# EasyEDA Pro project RCKid.epro, board TestBoard
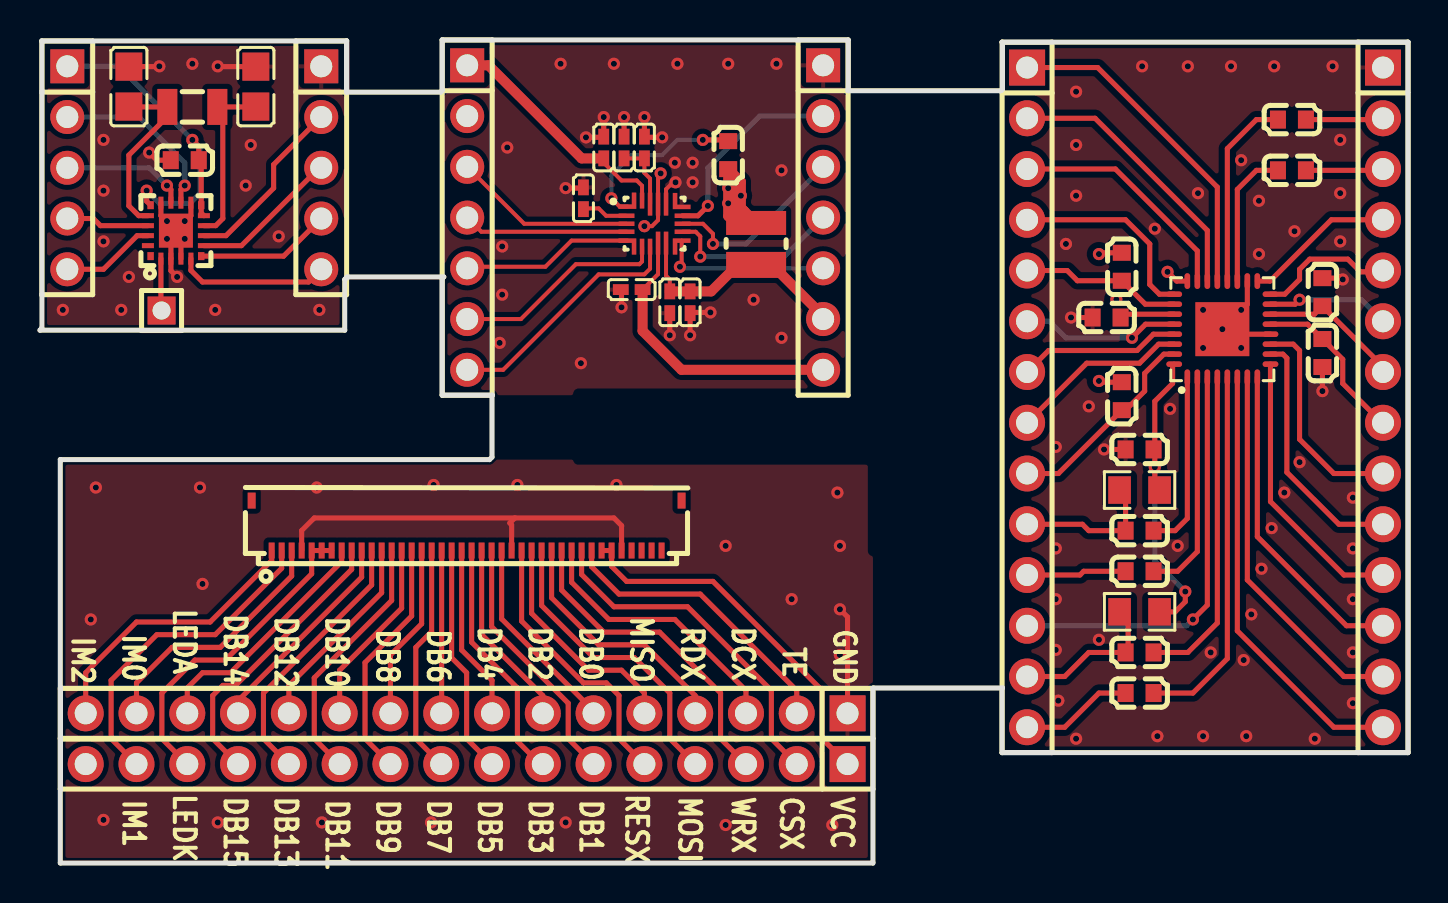
[diagram p25: board, top side]
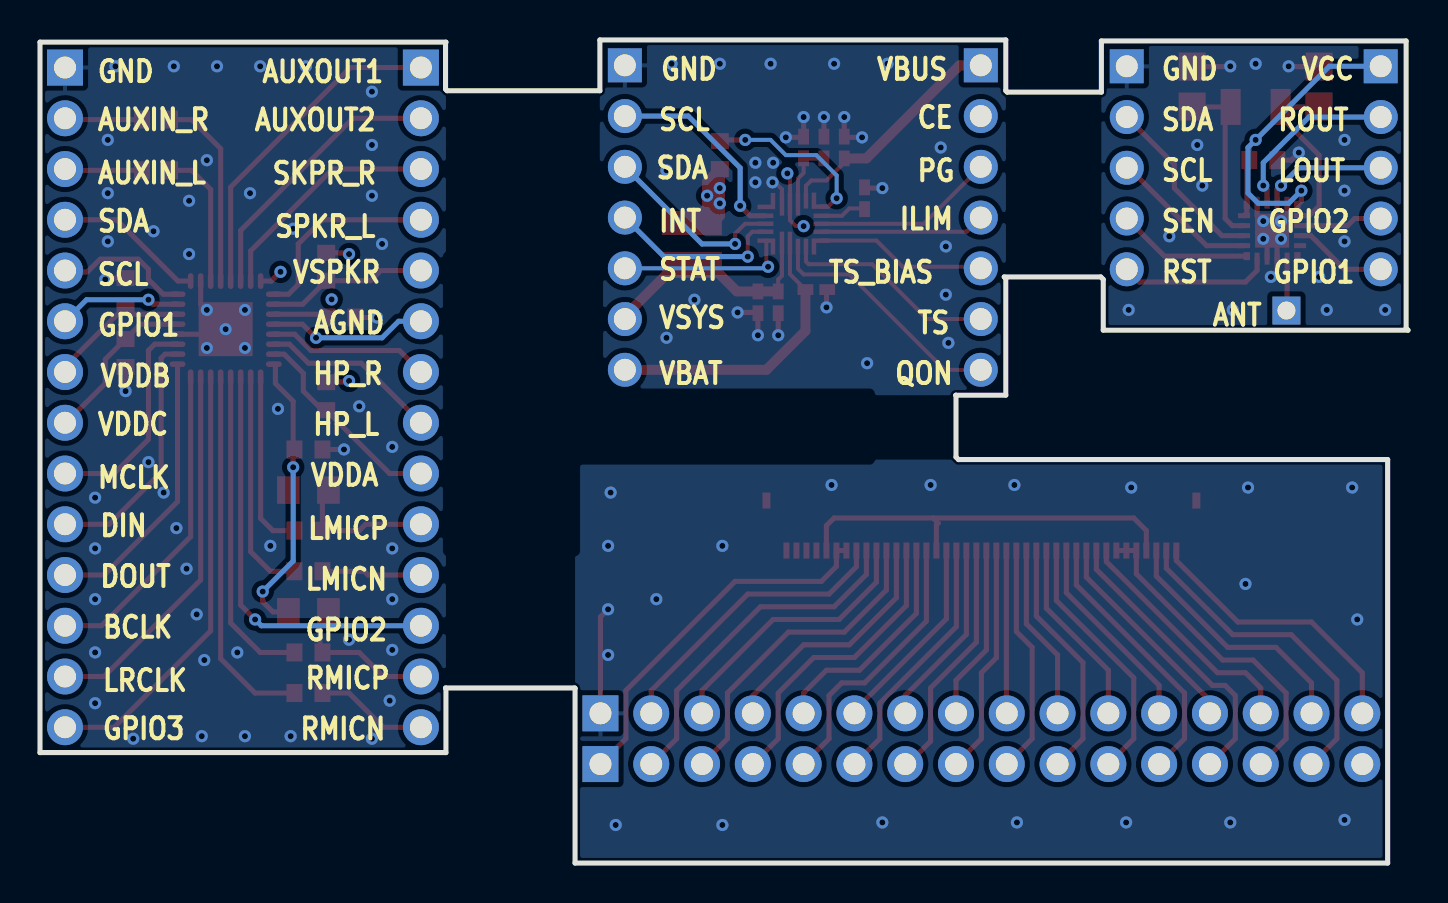
[diagram p26: board, bottom side, seen from below]

Outline 68.42 x 41.2 mm; copper layers: Top Layer, Inner1, Inner2, Bottom Layer. Coordinates in mm from the lower left corner of the outline.
Outline path: 0,26.67 0.09,26.77 0.09,41.15 15.33,41.15 15.33,38.59 20.04,38.59 20.11,38.66 20.11,41.2 40.42,41.2 40.42,38.66 48.05,38.66 48.13,38.73 48.13,41.07 48.11,41.09 68.42,41.09 68.42,5.53 48.11,5.53 48.11,8.75 48.13,8.76 41.68,8.76 41.66,8.74 41.66,0 1.02,0 1.02,20.19 22.48,20.19 22.61,20.32 22.61,23.41 22.61,23.42 20.11,23.42 20.11,29.26 20.19,29.34 15.37,29.34 15.24,29.21 15.24,26.67 0,26.67
Stack: Top Layer 0.035mm Outer layer thickness 1oz / Dielectric1 0.2104mm 7628 RC49% 8.6mil / Inner1 0.0152mm Inner layer thickness / Dielectric2 1.065mm 1.1mm H/HOZ Copper / Inner2 0.0152mm Inner layer thickness / Dielectric3 0.2104mm 7628 RC49% 8.6mil / Bottom Layer 0.035mm Outer layer thickness 1oz

## Design rules (mm)
template: JLCPCB Capability(Two Layers Board)
spacing copperThickness1oz (default): track to track 0.102, other pairs 0.152 to 0.3
spacing copperThickness2oz: track to track 0.203, other pairs 0.152 to 0.3
track width copperThickness1oz (default): min 0.127, default 0.254, max 2.54
track width copperThickness2oz: min 0.203, default 0.254, max 2.54
differential pair differentialPair (default): width min 0.127, default 0.254, max 2.54; gap min 0.152, default 0.152
via viaSize (default): diameter min 0.5, default 0.61, max 10; hole min 0.3, default 0.305, max 6.3

## Placement (name value [footprint] x y rotation side)
C5  47nF  [C0603]  34.42 35.43 270 top
C7  4.7uF  [C0603]  64.14 28.58 270 top
C8  4.7uF  [C0603]  54.1 23.37 90 top
C9  4.7uF  [C0603]  54.1 29.84 270 top
C10  4.7uF  [C0603]  64.14 25.53 90 top
C11  4.7uF  [C0603]  53.34 27.31 0 top
C12  4.7uF  [C0603]  54.99 20.7 180 top
C13  1uF  [C0603]  62.61 37.21 0 top
C14  1uF  [C0603]  62.61 34.67 0 top
C15  1uF  [C0603]  54.99 16.64 0 top
C16  1uF  [C0603]  54.99 14.61 0 top
C17  1uF  [C0603]  54.99 10.54 0 top
C18  1uF  [C0603]  54.99 8.51 0 top
C238  22pF  [C0805]  4.44 38.86 270 top
C239  22pF  [C0805]  10.8 38.86 90 top
C240  22nF  [C0603]  7.24 35.18 0 top
C241  10uF  [C0402]  29.21 35.81 270 top
C242  10uF  [C0402]  31.5 28.07 90 top
C243  10uF  [C0402]  32.51 28.07 90 top
C244  10uF  [C0402]  29.59 28.7 0 top
C245  1uF  [C0402]  28.19 35.81 270 top
C246  100nF  [C0402]  30.23 35.81 270 top
C247  4.7uF  [C0402]  27.18 33.27 270 top
FPC1  X05A10H40G  [FPC-SMD_X05A10H40G]  21.34 16.89 180 top
H1  -  [HDR-TH_14P-P2.54-V-M]  49.36 23.31 270 top
H2  -  [HDR-TH_14P-P2.54-V-M]  67.17 23.31 270 top
H3  -  [HDR-TH_7P-P2.54-V-M]  21.36 32.31 270 top
H4  -  [HDR-TH_7P-P2.54-V-M]  39.17 32.31 270 top
H5  -  [HDR-TH_1P-V-M_XKB_X4611WV-01I-C28D40]  6.08 27.66 0 top
H6  -  [HDR-TH_5P-P2.54-V-M]  1.36 34.8 270 top
H7  -  [HDR-TH_5P-P2.54-V-M]  14.06 34.8 270 top
H8  -  [HDR-TH_16P-P2.54-V-M]  21.34 4.95 180 top
H9  -  [HDR-TH_16P-P2.54-V-M]  21.34 7.49 180 top
L2  1uH  [IND-SMD_L3.0-W3.0_NR3010]  35.81 30.99 90 top
R1  2.2kΩ  [R0805]  54.99 12.57 0 top
R2  2.2kΩ  [R0805]  54.99 18.67 0 top
U1  NAU88C22YG  [QFN-32_L5.0-W5.0-P0.50-BL-EP2.7]  59.13 26.72 0 top
U2  BQ25628ERYKR  [WQFN-18_L3.0-W2.5-P0.40-TL_TI_RYK]  30.73 32 0 top
U3  SI4702-C19-GMR  [QFN-20_L3.0-W3.0-P0.50-BL-EP1.7_SI470XX-XXX]  6.8 31.65 0 top
X1  32.768kHz  [FC-135R_L3.2-W1.5]  7.62 37.85 180 top

## Footprints (pads in the part's own frame, mm; a bottom-side part is the same pattern mirrored in y, then rotated)
C0402
  rect 0.79x0.54 smd: 1(-0.545,0) 2(0.545,0)
C0603
  rect 0.8x0.9 smd: 1(-0.7,0) 2(0.7,0)
C0805
  rect 1.41x1.35 smd: 1(-1,0) 2(1,0)
FC-135R_L3.2-W1.5
  rect 1x1.8 smd: 1(-1.25,0) 2(1.25,0)
FPC-SMD_X05A10H40G
  rect 0.3x0.8 smd: 1(9.75,1.25) 2(9.25,1.25) 3(8.75,1.25) 4(8.25,1.25) 5(7.75,1.25) 6(7.25,1.25) 7(6.75,1.25) 8(6.25,1.25) 9(5.75,1.25) 10(5.25,1.25) 11(4.75,1.25) 12(4.25,1.25) 13(3.75,1.25) 14(3.25,1.25) 15(2.75,1.25) 16(2.25,1.25) 17(1.75,1.25) 18(1.25,1.25) 19(0.75,1.25) 20(0.25,1.25) 21(-0.25,1.25) 22(-0.75,1.25) 23(-1.25,1.25) 24(-1.75,1.25) 25(-2.25,1.25) 26(-2.75,1.25) 27(-3.25,1.25) 28(-3.75,1.25) 29(-4.25,1.25) 30(-4.75,1.25) 31(-5.25,1.25) 32(-5.75,1.25) 33(-6.25,1.25) 34(-6.75,1.25) 35(-7.25,1.25) 36(-7.75,1.25) 37(-8.25,1.25) 38(-8.75,1.25) 39(-9.25,1.25) 40(-9.75,1.25)
  rect 0.4x0.8 smd: 41(-10.75,-1.25) 42(10.75,-1.25)
HDR-TH_1P-V-M_XKB_X4611WV-01I-C28D40
  rect 1.4x1.4 hole 0.9: 1(0,0)
HDR-TH_5P-P2.54-V-M
  rect 1.7x1.7 hole 1.1: 1(-5.08,0)
  round 1.7 hole 1.1: 2(-2.54,0) 3(0,0) 4(2.54,0) 5(5.08,0)
HDR-TH_7P-P2.54-V-M
  rect 1.7x1.7 hole 1.1: 1(-7.62,0)
  round 1.7 hole 1.1: 2(-5.08,0) 3(-2.54,0) 4(0,0) 5(2.54,0) 6(5.08,0) 7(7.62,0)
HDR-TH_14P-P2.54-V-M
  rect 1.8x1.8 hole 1.1: 1(-16.51,0)
  round 1.8 hole 1.1: 2(-13.97,0) 3(-11.43,0) 4(-8.89,0) 5(-6.35,0) 6(-3.81,0) 7(-1.27,0) 8(1.27,0) 9(3.81,0) 10(6.35,0) 11(8.89,0) 12(11.43,0) 13(13.97,0) 14(16.51,0)
HDR-TH_16P-P2.54-V-M
  rect 1.8x1.8 hole 1.1: 1(-19.05,0)
  round 1.8 hole 1.1: 2(-16.51,0) 3(-13.97,0) 4(-11.43,0) 5(-8.89,0) 6(-6.35,0) 7(-3.81,0) 8(-1.27,0) 9(1.27,0) 10(3.81,0) 11(6.35,0) 12(8.89,0) 13(11.43,0) 14(13.97,0) 15(16.51,0) 16(19.05,0)
IND-SMD_L3.0-W3.0_NR3010
  rect 1.3x3 smd: 1(-1.05,0)
  rect 1.2x3 smd: 2(1.05,0)
QFN-20_L3.0-W3.0-P0.50-BL-EP1.7_SI470XX-XXX
  rect 0.32x0.4 smd: 1(-1.265,-1.275) 6(1.265,-1.275) 11(1.265,1.275) 16(-1.265,1.275)
  rect 0.25x0.6 smd: 2(-0.75,-1.4) 3(-0.25,-1.4) 4(0.25,-1.4) 5(0.75,-1.4) 12(0.75,1.4) 13(0.25,1.4) 14(-0.25,1.4) 15(-0.75,1.4)
  rect 0.6x0.25 smd: 7(1.4,-0.75) 8(1.4,-0.25) 9(1.4,0.25) 10(1.4,0.75) 17(-1.4,0.75) 18(-1.4,0.25) 19(-1.4,-0.25) 20(-1.4,-0.75)
  rect 1.7x1.7 smd: 21(0,0)
QFN-32_L5.0-W5.0-P0.50-BL-EP2.7
  oval 0.28x0.79 smd: 1(-1.75,-2.408) 2(-1.25,-2.408) 3(-0.75,-2.408) 4(-0.25,-2.408) 5(0.25,-2.408) 6(0.75,-2.408) 7(1.25,-2.408) 8(1.75,-2.408) 17(1.75,2.408) 18(1.25,2.408) 19(0.75,2.408) 20(0.25,2.408) 21(-0.25,2.408) 22(-0.75,2.408) 23(-1.25,2.408) 24(-1.75,2.408)
  oval 0.79x0.28 smd: 9(2.408,-1.75) 10(2.408,-1.25) 11(2.408,-0.75) 12(2.408,-0.25) 13(2.408,0.25) 14(2.408,0.75) 15(2.408,1.25) 16(2.408,1.75) 25(-2.408,1.75) 26(-2.408,1.25) 27(-2.408,0.75) 28(-2.408,0.25) 29(-2.408,-0.25) 30(-2.408,-0.75) 31(-2.408,-1.25) 32(-2.408,-1.75)
  rect 2.7x2.7 smd: 33(0,0)
R0805
  rect 1.133x1.377 smd: 1(-1,0) 2(1,0)
WQFN-18_L3.0-W2.5-P0.40-TL_TI_RYK
  custom 0.889x0.814 smd: 1(-1.357,0.85) 5(-1.357,-0.85) 10(1.357,-0.85) 14(1.357,0.836)
  rect 0.795x0.224 smd: 2(-1.403,0.393) 3(-1.403,-0.007) 4(-1.403,-0.407) 11(1.403,-0.407) 12(1.403,-0.007) 13(1.403,0.393)
  rect 0.224x0.795 smd: 6(-0.625,-1.153) 7(-0.225,-1.153) 18(-0.625,1.153)
  rect 0.224x1.15 smd: 8(0.175,-0.976) 9(0.575,-0.976) 15(0.575,0.976) 16(0.175,0.977) 17(-0.225,0.977)

## Nets
As in the schematic.

Pads without a net: FPC1 37 38 39 40 41 42; H8 16; U3 1 20

## Via types
v1: diameter 0.61, hole 0.305, Top Layer to Bottom Layer, 145 vias

## Routing (per net, layer and track width the routed paths; a pad name or vN(x,y) marks a point on that pad's centre or on a via; arc(x,y) is an arc through that point)
AGND: length 11.5
  Top Layer w0.254: C9.1 53.02,30.55 v1(52.96,30.48) ; U1.24 56.85,29.13 v1(56.39,29.59) ; v1(54.61,26.29) 55.29,26.97 U1.28 ; v1(52.96,24.13) 53.02,24.07 54.1,24.07
  Bottom Layer w0.254: H1.6 50.48,27.12 51.31,26.29 v1(54.61,26.29)
  vias: v1(53.83,28.21)
GND: length 59
  Top Layer w0.2: U2.15 31.31,33.72 31.66,34.07 v1(31.78,34.07)
  Top Layer w0.254: U3.4 7.05,31.4 U3.21 ; U3.21 6.55,31.4 U3.3 6.55,29.65 v1(6.86,29.34) ; U3.21 6.05,32.4 U3.15 ; U3.21 7.55,32.4 U3.12 ; C11.1 v1(51.56,27.31) ; v1(31.5,26.42) C242.1 ; v1(33.53,27.56) 32.55,27.56 C243.1 v1(32.51,26.42) ; 23.75,17.27 28.7,17.27 29.09,16.89 FPC1.36 ; 23.75,17.27 23.49,17.02 23.59,16.93 FPC1.25 ; 23.75,17.27 13.72,17.27 13.09,16.64 FPC1.4 ; v1(29.08,27.81) 29.08,28.67 C244.1 ; v1(30.23,37.34) C246.1 30.26,36.32 v1(31.11,36.32) ; v1(27.3,36.32) 28.16,36.32 C245.1 v1(28.19,37.34) ; v1(8.89,39.88) 8.91,39.86 C239.2 ; v1(5.97,39.88) 5.95,39.86 C238.1 ; v1(26.29,33.78) 27.14,33.78 C247.1 ; C7.1 65.09,29.28 v1(65.15,29.21) ; C240.1 5.84,35.18 v1(5.46,35.56) ; v1(29.21,37.34) C241.1 ; U1.18 60.38,27.97 v1(59.13,26.72) 59.38,26.47 U1.12 ; C12.2 v1(53.21,20.7) ; v1(40,12.7) 40.39,12.32 40.39,7.49 ; C10.1 v1(64.14,23.62)
  vias: v1(1.14,27.69) v1(2.54,12.19) v1(2.79,18.8) v1(3.17,36.2) v1(3.17,33.66) v1(3.17,31.12) v1(3.17,2.16) v1(4.06,27.69) v1(4.44,29.34) v1(6.35,32.13) v1(6.35,31.24) v1(7.24,32.13) v1(7.24,31.24) v1(7.62,40) v1(8,18.8) v1(8.13,13.97) v1(8.76,27.69) v1(8.89,2.03) v1(10.29,33.91) v1(10.54,35.94) v1(11.94,31.37) v1(13.84,18.8) v1(13.97,27.69) v1(14.1,2.03) v1(19.56,2.03) v1(19.68,18.92) v1(22.99,26.03) v1(23.11,30.86) v1(23.11,28.45) v1(23.37,35.81) v1(23.88,18.92) v1(26.03,40) v1(26.29,2.03) v1(27.05,25.02) v1(28.7,40) v1(28.83,18.92) v1(31.75,35.05) v1(31.88,40) v1(32.64,35.05) v1(32.64,34.07) v1(34.29,15.88) v1(34.29,1.91) v1(34.42,40) v1(35.69,28.19) v1(36.83,40) v1(37.08,34.67) v1(37.08,26.29) v1(37.59,13.21) v1(39.62,1.91) v1(39.88,18.54) v1(40,15.88) v1(40,10.41) v1(50.8,20.83) v1(50.8,15.75) v1(50.8,13.21) v1(50.8,10.67) v1(50.93,8.13) v1(51.31,30.99) v1(51.82,38.61) v1(51.82,35.94) v1(51.82,33.4) v1(51.82,6.22) v1(52.45,22.86) v1(52.96,11.18) v1(55.12,39.88) v1(55.75,31.75) v1(55.88,6.35) v1(56.52,22.73) v1(56.9,15.88) v1(57.4,39.88) v1(57.91,33.53) v1(58.17,27.69) v1(58.17,25.78) v1(58.17,6.35) v1(58.55,10.54) v1(59.56,39.88) v1(60.07,35.18) v1(60.07,27.69) v1(60.07,25.78) v1(60.2,10.16) v1(60.33,6.35) v1(60.58,12.45) v1(60.96,33.15) v1(60.96,30.48) v1(61.09,14.73) v1(61.59,16.76) v1(61.72,39.88) v1(62.23,18.54) v1(62.74,31.62) v1(62.99,20.07) v1(63.75,6.22) v1(64.64,39.88) v1(65.02,36.2) v1(65.02,33.53) v1(65.02,31.12) v1(65.66,18.29) v1(65.66,15.75) v1(65.66,13.21) v1(65.66,10.54) v1(65.66,8)
VBAT: length 14.6
  Top Layer w0.2: C244.2 30.91,29.48 U2.8
  Top Layer w0.5: H4.7 32.08,24.69 30.14,26.63 C244.2
VBUS: length 12.1
  Top Layer w0.2: C245.2 28.19,35.05 29.08,34.16 29.84,34.16 30.11,33.9 U2.18
  Top Layer w0.5: C245.2 27.09,35.27 22.43,39.93 H3.1
VCC: length 37.2
  Top Layer w0.254: U3.10 8.06,32.54 U3.11 8.06,35.06 C240.2 7.94,35.88 v1(7.62,36.2) ; v1(5.33,33.66) 5.33,33.13 U3.16 ; FPC1.34 FPC1.35 28.59,14.85 29.34,14.1 33.65,14.1 39.12,8.64 39.12,6.22 40.39,4.95
  Bottom Layer w0.254: H6.1 3.94,39.88 v1(7.62,36.2) 8,35.81 8,33.53 7.49,33.02 5.97,33.02 v1(5.33,33.66)
VDDA: length 10.4
  Top Layer w0.254: H1.9 50.93,19.5 C8.1 54.29,22.67 55.24,23.62 55.24,24.51 56.2,25.47 U1.31
VDDB: length 7.3
  Top Layer w0.254: H2.7 67.17,24.84 C7.2 63.73,27.47 U1.14
VDDC: length 8.4
  Top Layer w0.254: H2.8 67.12,22.04 65.15,24 65.15,25.21 C10.2 63.39,26.97 U1.13
AUXIN_L: length 3.9
  Top Layer w0.254: H2.3 67.1,34.67 C14.2
AUXIN_R: length 3.9
  Top Layer w0.254: H2.2 67.1,37.21 C13.2
AUXOUT1: length 16.7
  Top Layer w0.254: H1.1 52.89,39.82 58.88,33.83 U1.21
AUXOUT2: length 13.9
  Top Layer w0.254: U1.22 58.38,31.66 52.77,37.28 H1.2
BCLK: length 16.1
  Top Layer w0.254: H2.12 65.34,11.88 60.88,16.34 U1.8
CSX: length 17.3
  Top Layer w0.254: FPC1.32 27.09,14.44 28.7,12.83 32.39,12.83 36.58,8.64 36.58,6.22 H8.2
DB0: length 10.1
  Top Layer w0.254: H9.6 27.69,7.62 23.09,12.22 FPC1.24
DB1: length 12.8
  Top Layer w0.254: FPC1.23 22.59,11.83 26.42,8 26.42,6.22 H8.6
DB2: length 9.4
  Top Layer w0.254: FPC1.22 22.09,11.44 25.15,8.38 H9.7
DB3: length 12.2
  Top Layer w0.254: H8.7 25.02,4.95 23.88,6.1 23.88,8.76 21.59,11.05 FPC1.21
DB4: length 8.8
  Top Layer w0.254: FPC1.20 21.09,10.66 22.61,9.14 H9.8
DB5: length 11.5
  Top Layer w0.254: FPC1.19 20.59,10.28 21.34,9.53 21.34,6.22 H8.8
DB6: length 8.2
  Top Layer w0.254: H9.9 20.09,7.51 FPC1.18
DB7: length 11.5
  Top Layer w0.254: H8.9 18.8,6.22 18.8,10.8 19.59,11.59 FPC1.17
DB8: length 8.8
  Top Layer w0.254: H9.10 17.53,10.41 19.09,11.97 FPC1.16
DB9: length 12.2
  Top Layer w0.254: FPC1.15 18.59,12.36 16.26,10.03 16.26,6.22 H8.10
DB10: length 9.4
  Top Layer w0.254: FPC1.14 18.09,12.75 14.99,9.65 14.99,7.49
DB11: length 12.8
  Top Layer w0.254: 14.99,4.95 13.72,6.22 13.72,9.27 17.59,13.14 FPC1.13
DB12: length 10.1
  Top Layer w0.254: H9.12 12.45,8.89 17.09,13.53 FPC1.12
DB13: length 13.5
  Top Layer w0.254: FPC1.11 16.59,13.92 11.18,8.51 11.18,6.22 H8.12
DB14: length 10.7
  Top Layer w0.254: H9.13 9.91,8.13 16.09,14.31 FPC1.10
DB15: length 14.5
  Top Layer w0.254: FPC1.9 15.59,14.7 9.78,8.89 9.14,8.89 8.64,8.38 8.64,6.22 H8.13
DCX: length 13.7
  Top Layer w0.254: H9.3 35.31,8.64 31.75,12.19 28.45,12.19 26.59,14.05 FPC1.31
DIN: length 12.5
  Top Layer w0.254: H2.10 64.96,16.96 62.36,19.56 62.36,25.27 62.16,25.47 U1.10
DOUT: length 14
  Top Layer w0.254: U1.9 61.54,18.09 65.21,14.42 H2.11
GPIO1: length 10.9
  Top Layer w0.254: H6.5 3.18,29.72 4.86,31.4 U3.19 ; v1(62.99,28.19) 62.77,27.97 U1.15
  Bottom Layer w0.254: v1(62.99,28.19) 66.09,28.19 H2.6
GPIO2: length 25
  Top Layer w0.254: v1(57.66,12.19) 58.38,12.91 U1.3 ; 2.67,32.26 3.02,31.9 U3.18 ; 2.67,32.26 H6.4
  Bottom Layer w0.254: H1.12 57.34,11.88 v1(57.66,12.19)
GPIO3: length 22
  Top Layer w0.254: U1.6 59.88,11.62 64.7,6.8 H2.14
HP_L: length 9
  Top Layer w0.254: H1.8 52.35,25.02 54.99,25.02 55.94,25.97 U1.30
HP_R: length 8.1
  Top Layer w0.254: U1.29 55.68,26.47 54.86,25.65 50.44,25.65 H1.7
ILIM: length 8.3
  Top Layer w0.2: H3.4 22.08,31.6 U2.4
IM0: length 12.8
  Top Layer w0.254: H9.15 4.83,9.02 6.6,10.8 9.02,10.8 12.59,14.36 FPC1.3
IM1: length 16.5
  Top Layer w0.254: FPC1.2 12.09,14.75 8.76,11.43 5.84,11.43 3.56,9.14 3.56,6.22 H8.15
IM2: length 14.2
  Top Layer w0.254: H9.16 2.29,9.53 4.83,12.06 8.51,12.06 11.59,15.14 FPC1.1
INT: length 8.9
  Top Layer w0.2: U2.11 32.79,31.6 33.02,31.37 v1(33.02,30.35)
  Bottom Layer w0.254: v1(33.02,30.35) 37.21,30.35 H4.4
LED_A: length 12.2
  Top Layer w0.254: H9.14 7.37,8.76 8.13,9.53 9.52,9.53 15.09,15.09 FPC1.8
LED_K: length 16.2
  Top Layer w0.254: FPC1.7 FPC1.6 FPC1.5 13.59,14.48 9.27,10.16 7.75,10.16 6.1,8.51 6.1,6.22 H8.14
LMICN: length 5
  Top Layer w0.254: H1.11 52.01,14.42 52.2,14.61 C16.1
LMICP: length 7.2
  Top Layer w0.254: R2.1 54.29,18.37 C15.1 52.45,16.64 52.13,16.96 H1.10
LOUT: length 6.3
  Top Layer w0.254: v1(6.35,33.91) 6.55,33.71 U3.14
  Bottom Layer w0.254: H6.3 5.46,34.8 v1(6.35,33.91)
LRCLK: length 18.9
  Top Layer w0.254: H2.13 65.21,9.34 60.38,14.17 U1.7
MCLK: length 10.9
  Top Layer w0.254: U1.11 62.68,25.97 62.99,25.65 62.99,21.21 64.7,19.5 H2.9
MISO: length 11.5
  Top Layer w0.254: FPC1.27 24.59,12.5 27.43,9.65 29.08,9.65 30.23,8.51 H9.5
MOSI: length 15.1
  Top Layer w0.254: FPC1.28 25.09,12.89 27.69,10.29 29.72,10.29 31.5,8.51 31.5,6.22 H8.4
PG: length 9.1
  Top Layer w0.2: H3.3 24.21,32 U2.3
QON: length 12.3
  Top Layer w0.2: U2.7 30.51,29.75 30.23,29.46 27.94,29.46 23.16,24.69 H3.7
RDX: length 12.5
  Top Layer w0.254: FPC1.29 25.59,13.28 27.94,10.92 30.23,10.92 32.77,8.38 H9.4
RESX: length 13.9
  Top Layer w0.254: H8.5 28.96,6.22 28.96,8.38 28.32,9.02 27.18,9.02 24.09,12.11 FPC1.26
RMICN: length 5.6
  Top Layer w0.254: H1.14 51.25,6.8 52.96,8.51 C18.1
RMICP: length 7.6
  Top Layer w0.254: C17.1 52.45,10.54 51.25,9.34 H1.13 ; 54.42,10.54 54.42,12.15 R1.1
ROUT: length 8.9
  Top Layer w0.254: v1(7.24,33.91) 7.05,33.72 U3.13
  Bottom Layer w0.254: v1(7.24,33.91) 7.24,35.05 4.95,37.34 H6.2
RST: length 7.6
  Top Layer w0.254: H7.5 13.43,29.08 8.13,29.08 7.55,29.66 U3.5
SCL: length 24.6
  Top Layer w0.254: U2.13 32.9,32.4 v1(33.4,32.89) ; U3.7 10.07,30.9 13.97,34.8 H7.3 ; U1.16 62.25,28.47 62.99,29.21 62.99,29.72 63.5,30.23 65.4,30.23 66.04,29.59 67.1,29.59 H2.5
  Bottom Layer w0.254: v1(33.4,32.89) 33.4,34.8 35.99,37.39 H4.2
SDA: length 25.9
  Top Layer w0.2: U2.12 33.15,32 33.65,31.5 v1(33.65,30.99)
  Top Layer w0.254: U3.8 9.3,31.4 11.68,33.78 11.68,34.96 H7.2 ; U1.17 61.51,29.13 64.58,32.2 H2.4
  Bottom Layer w0.254: v1(33.65,30.99) 35.31,30.99 H4.3
SEN: length 6.8
  Top Layer w0.254: H7.4 12.18,30.38 U3.6
SPKR_L: length 10.1
  Top Layer w0.254: U1.25 55.98,28.47 55.5,28.96 55.5,30.99 54.29,32.2 H1.4
SPKR_R: length 11.7
  Top Layer w0.254: U1.23 57.88,30.64 53.78,34.74 H1.3
STAT: length 8.5
  Top Layer w0.2: U2.10 32.09,29.93 v1(32,29.84)
  Bottom Layer w0.2: H4.5 32.08,29.77 v1(32,29.84)
TE: length 14.8
  Top Layer w0.254: H9.2 37.85,8.64 33.02,13.46 28.96,13.46 27.59,14.83 FPC1.33
TS: length 10.7
  Top Layer w0.2: U2.6 30.11,30.11 29.97,29.97 26.8,29.97 24.05,27.23 H3.6
TS_BIAS: length 8.6
  Top Layer w0.2: H3.5 21.44,29.84 25.27,29.84 26.58,31.15 U2.5
VSPKR: length 8.1
  Top Layer w0.254: U1.26 55.28,27.97 C9.2 51.88,29.14 51.37,29.66 H1.5
VSYS: length 11.9
  Top Layer w0.2: C242.2 31.5,29.21 31.31,29.4 U2.9
  Top Layer w0.5: H4.6 39.17,27.38 36.61,29.94 34.89,29.94 33.56,28.61 C243.2 C242.2
WRX: length 16.1
  Top Layer w0.254: H8.3 34.04,6.22 34.04,8.51 30.99,11.56 28.19,11.56 26.09,13.67 FPC1.30
$1N1172: length 9.8
  Top Layer w0.254: U1.20 59.38,35.76 60.83,37.21 C13.1
$1N1178: length 7
  Top Layer w0.254: C14.1 60.83,34.67 59.88,33.72 U1.19
$1N1197: length 2.8
  Top Layer w0.254: 54.04,27.31 54.21,27.47 U1.27
$1N1203: length 15.7
  Top Layer w0.254: R2.2 55.75,18.91 v1(55.75,19.81) 55.75,20.64 C12.1 55.75,20.76 55.75,23.11 56.64,24 56.64,24.89 U1.32 ; v1(57.28,13.59) 57.28,13.08 56.77,12.57 R1.2
  Bottom Layer w0.254: v1(55.75,19.81) 55.75,15.11 v1(57.28,13.59)
$1N1221: length 18.4
  Top Layer w0.254: U1.5 59.38,10.23 57.66,8.51 55.82,8.51
$1N1237: length 16
  Top Layer w0.254: U1.4 58.88,12.02 57.4,10.54 55.82,10.54
$1N1247: length 9
  Top Layer w0.254: U1.1 57.38,17.25 56.77,16.64 C15.2
$1N1254: length 11.3
  Top Layer w0.254: U1.2 57.88,15.59 56.9,14.61 C16.2
$2N763: length 3.4
  Top Layer w0.2: C241.2 C246.2 30.23,34.54 30.51,34.26 U2.17
$2N779: length 12.1
  Top Layer w0.2: v1(30.23,31.88) 30.61,31.88 30.91,32.18 U2.16 30.91,34.39 v1(31.04,34.52)
  Top Layer w0.5: v1(35.05,33.4) 35.05,34.1 C5.2 34.42,34.04 v1(35.05,33.4) ; v1(35.05,33.4) 35.05,32.8 ; 35.21,32.64 34.67,32.64 34.67,33.18 ; 35.21,32.64 35.05,32.8 ; 35.21,32.64 L2.2 ; 35.05,32.8 34.67,33.18 ; 34.67,33.18 34.67,33.27 ; v1(34.42,33.78) v1(34.42,33.02) 34.42,32.39 34.76,32.04 35.18,32.04
$2N785: length 8.7
  Top Layer w0.2: U2.1 28.99,32.85 v1(28.58,33.27)
  Top Layer w0.254: v1(33.15,36.2) 34.36,36.2 C5.1
  Bottom Layer w0.2: v1(33.15,36.2) 31.88,36.2 31.11,35.43 29.59,35.43 28.58,34.42 v1(28.58,33.27)
$2N832: length 2.3
  Top Layer w0.2: U2.2 28.31,32.4 27.94,32.77 27.21,32.77 C247.2
$3N389: length 8.7
  Top Layer w0.254: C239.1 10.78,37.85 X1.1 9.14,37.57 9.14,32.26 8.79,31.9 U3.9
$3N395: length 8.8
  Top Layer w0.254: U3.17 4.94,32.4 4.44,32.89 4.44,35.43 6.37,37.36 X1.2 4.46,37.85 C238.2
$3N930: length 2.6
  Top Layer w0.254: U3.2 6.05,27.69 H5.1

## Copper pours and planes (outline as drawn; the poured copper is in the pictures)
AGND on Inner1: 52.7,31.37 56.77,31.37 56.77,23.62 52.7,23.62
GND on Top Layer: 20.11,41.2 40.42,41.2 40.42,23.42 20.11,23.42
GND on Top Layer: 1.02,20.19 41.66,20.19 41.66,0 1.02,0
GND on Top Layer: 0.09,41.15 15.37,41.15 15.37,26.67 0.09,26.67
GND on Top Layer: 48.11,41.09 68.42,41.09 68.42,5.53 48.11,5.53
GND on Bottom Layer: 48.11,41.09 68.42,41.09 68.42,5.53 48.11,5.53
GND on Bottom Layer: 1.02,20.19 41.66,20.19 41.66,0 1.02,0
GND on Bottom Layer: 0.09,41.15 15.33,41.15 15.33,26.77 0.09,26.77
GND on Bottom Layer: 20.11,41.2 40.42,41.2 40.42,23.42 20.11,23.42
GND on Inner1: 0.09,41.15 15.33,41.15 15.33,26.77 0.09,26.77
GND on Inner1: 48.11,41.09 68.42,41.09 68.42,5.53 48.11,5.53
GND on Inner1: 1.02,20.19 41.66,20.19 41.66,0 1.02,0
GND on Inner1: 20.11,41.2 40.42,41.2 40.42,23.42 20.11,23.42
GND on Inner2: 1.02,20.19 41.66,20.19 41.66,0 1.02,0
GND on Inner2: 0.09,41.15 15.37,41.15 15.37,26.67 0.09,26.67
GND on Inner2: 20.11,41.2 40.42,41.2 40.42,23.42 20.11,23.42
GND on Inner2: 48.11,41.09 68.42,41.09 68.42,5.53 48.11,5.53
$2N779 on Inner1: 29.84,34.8 35.43,34.8 35.43,31.5 29.84,31.5

## Text on the board
Bottom Silkscreen Layer: VCC | ROUT | LOUT | GPIO1 | GPIO2 | ANT | GND | SDA | SCL | SEN | RST | CE | PG | TS | ILIM | QON | VBUS | TS_BIAS | INT | STAT | VSYS | VBAT | AGND | HP_R | HP_L | VDDA | LMICP | LMICN | RMICP | RMICN | VSPKR | SPKR_L | SKPR_R | AUXOUT1 | AUXOUT2 | BCLK | LRCLK | GPIO3 | VDDB | DIN | DOUT | AUXIN_R | AUXIN_L | VDDC | MCLK
Top Silkscreen Layer: IM2 | IM0 | IM1 | LEDA | LEDK | DB14 | DB15 | DB12 | DB13 | DB10 | DB11 | DB8 | DB9 | DB6 | DB7 | DB4 | DB5 | DB2 | DB3 | DB0 | DB1 | RESX | MISO | MOSI | RDX | DCX | WRX | CSX | TE | VCC | GND
